# EAGLE design sortirovka (EAGLE 8.0.1)
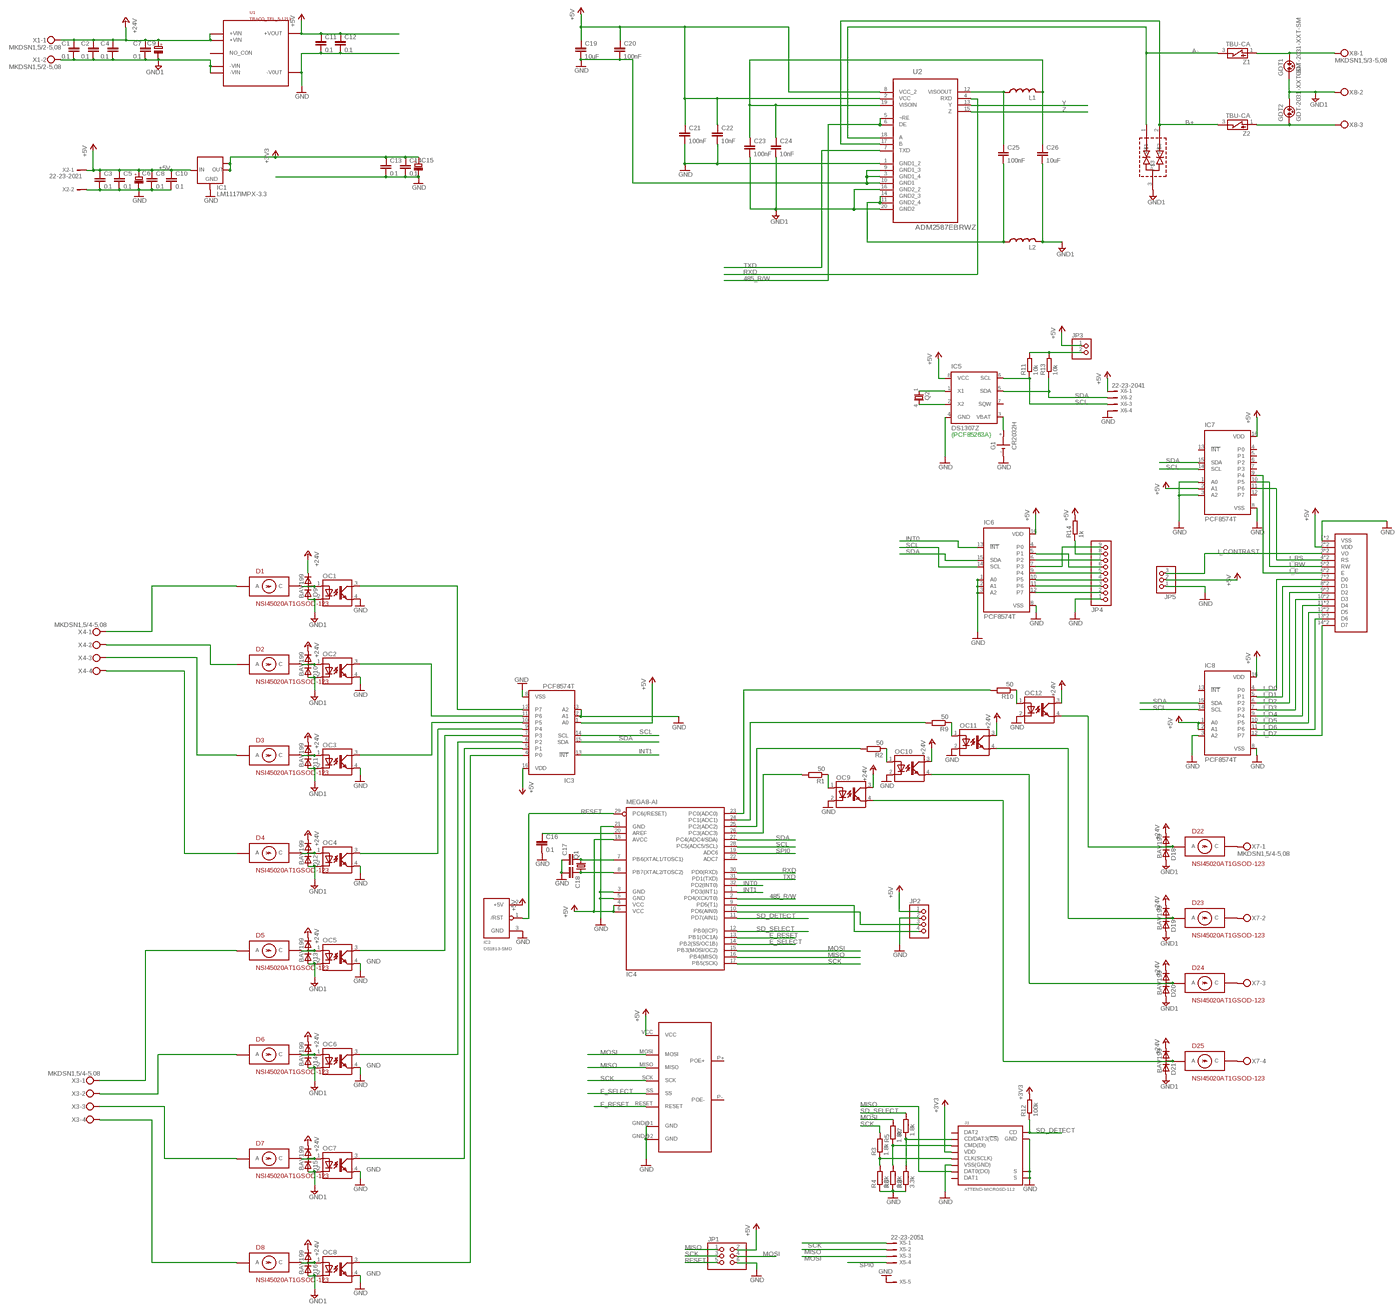
[diagram p0: schematic, sheet 1, overview]
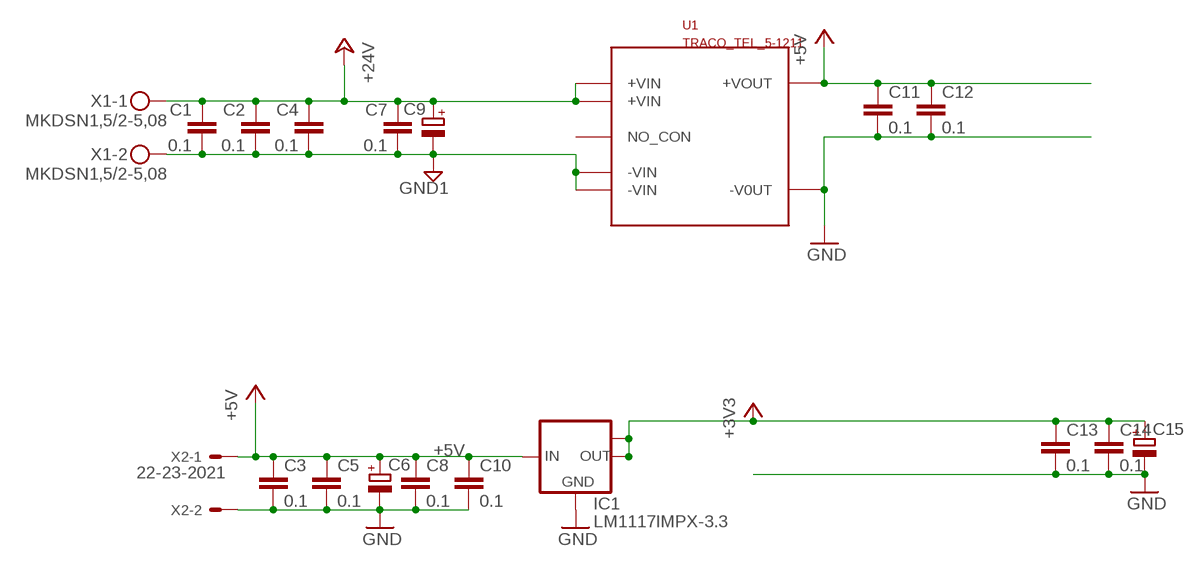
[diagram p1: schematic, sheet 1, part 1 of 4]
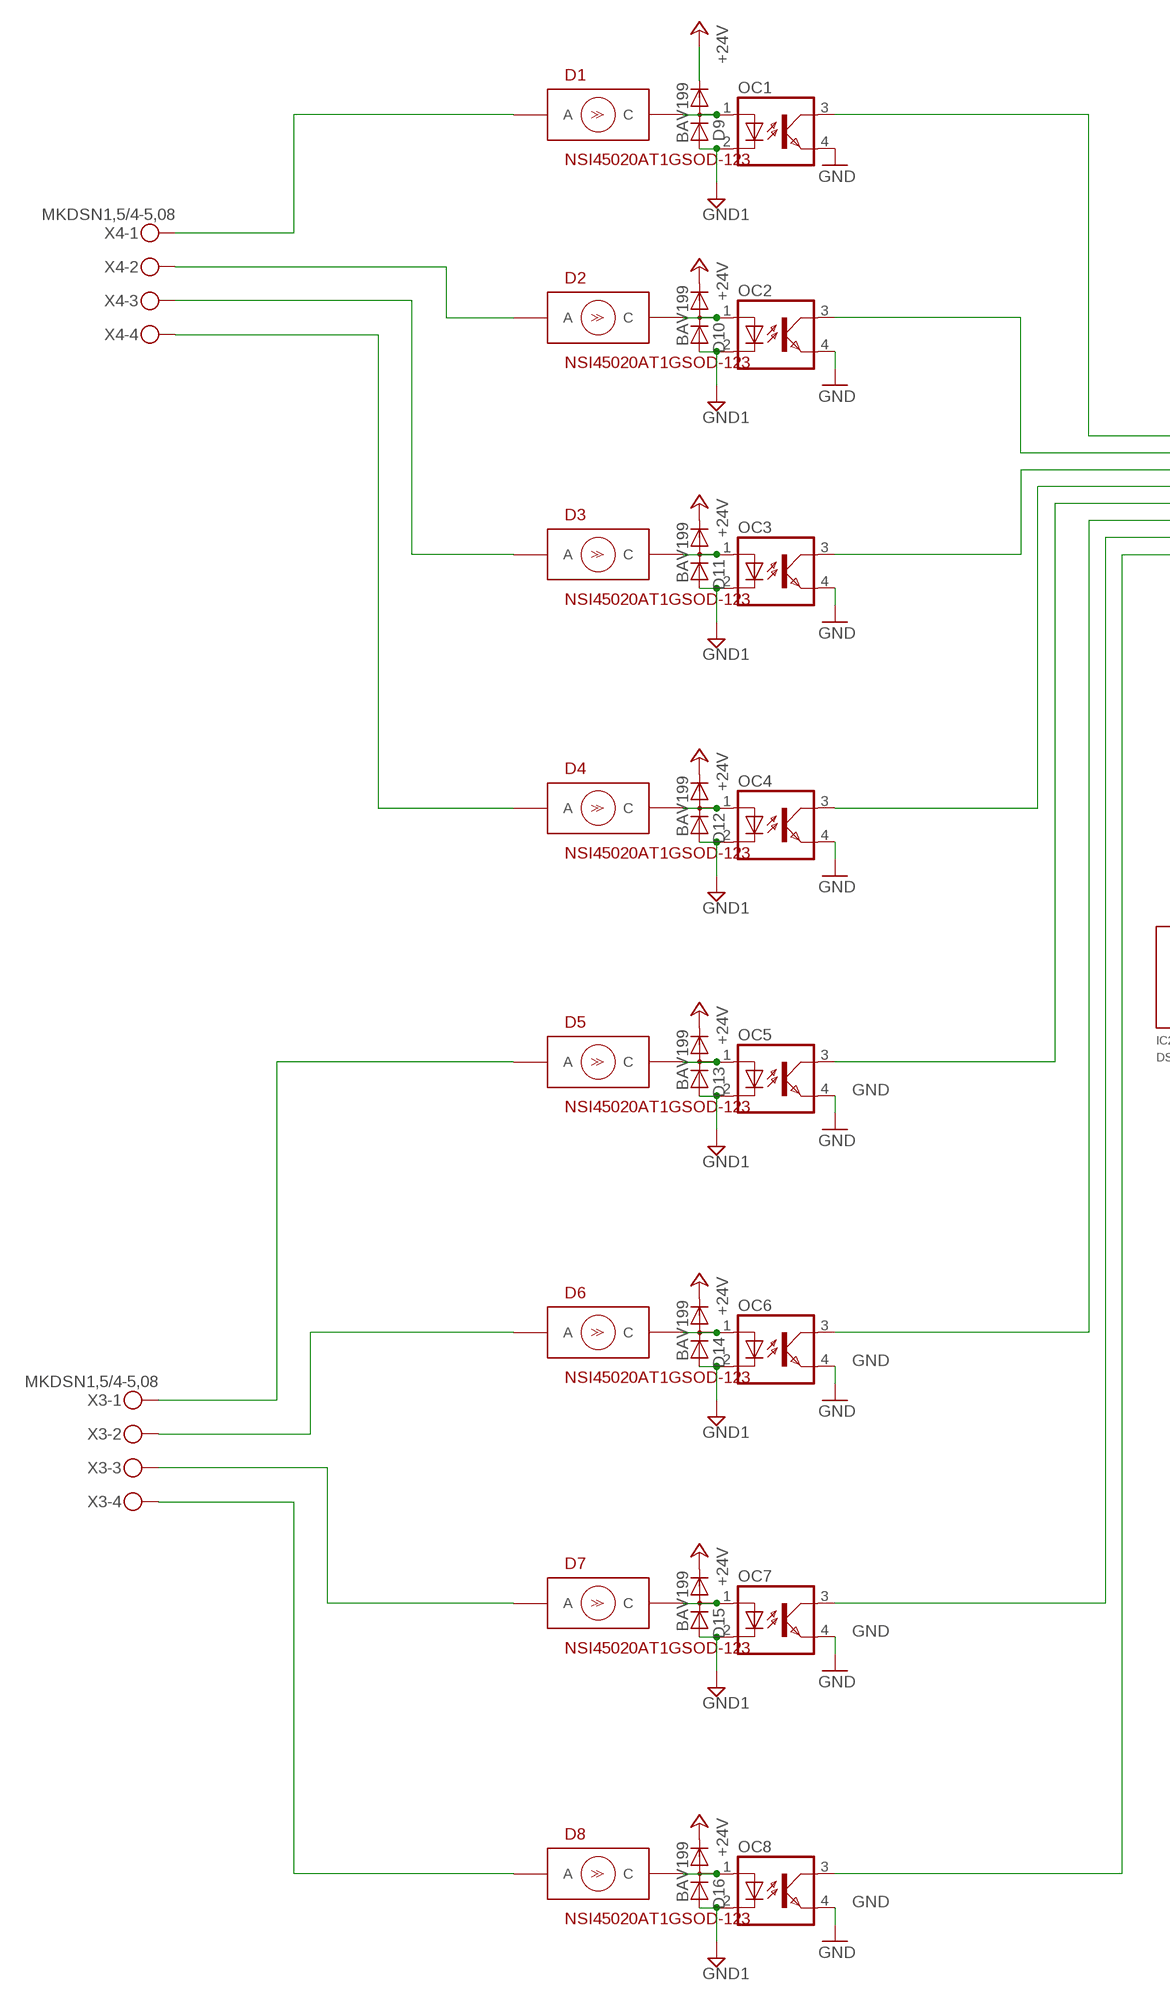
[diagram p2: schematic, sheet 1, part 2 of 4]
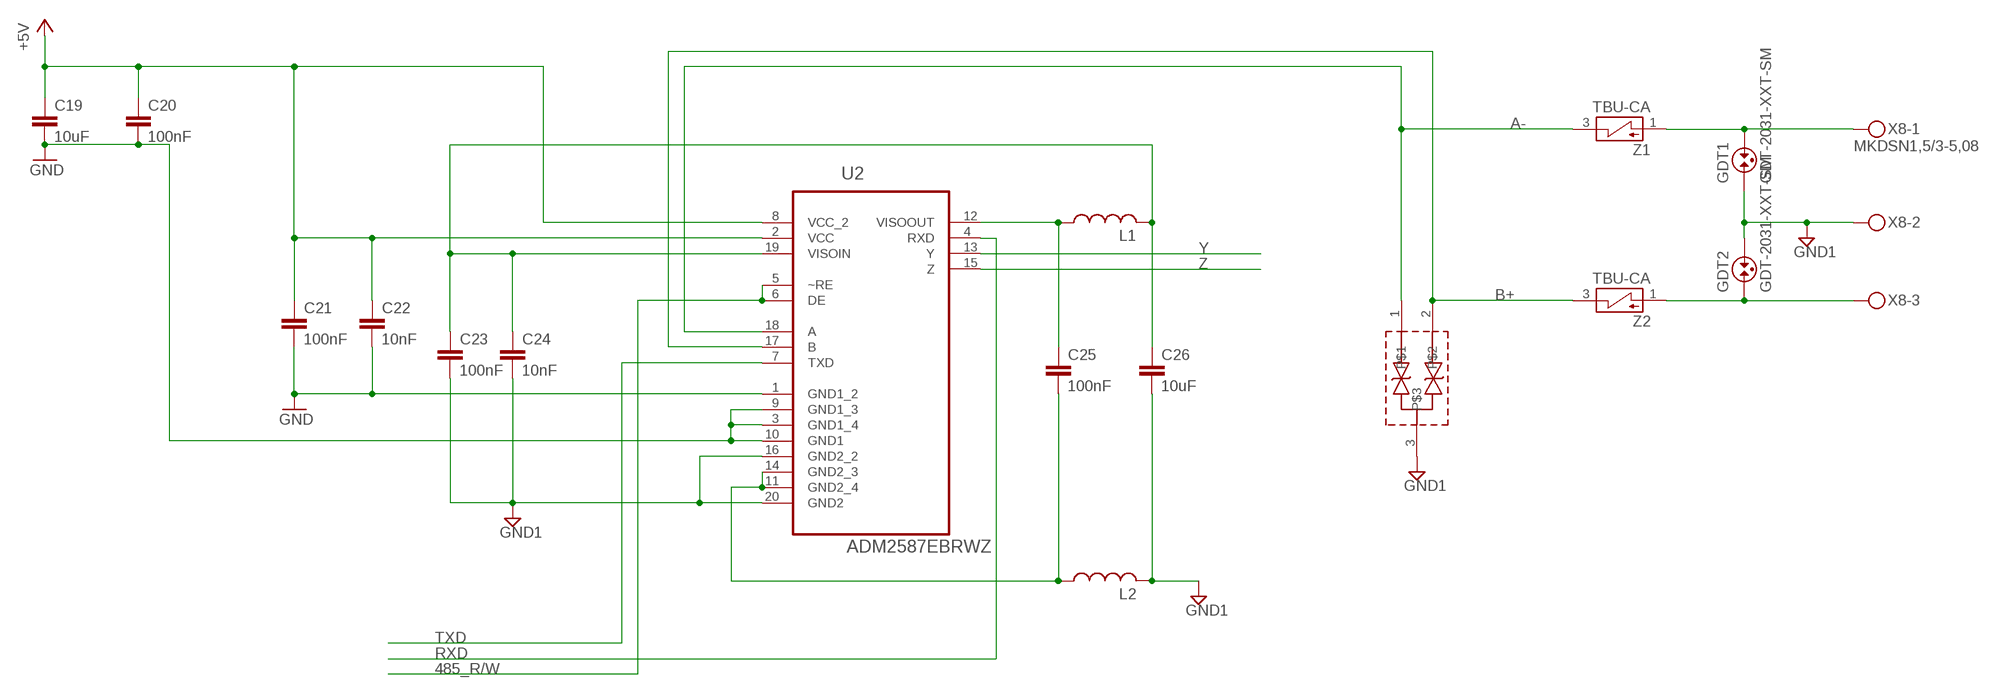
[diagram p3: schematic, sheet 1, part 3 of 4]
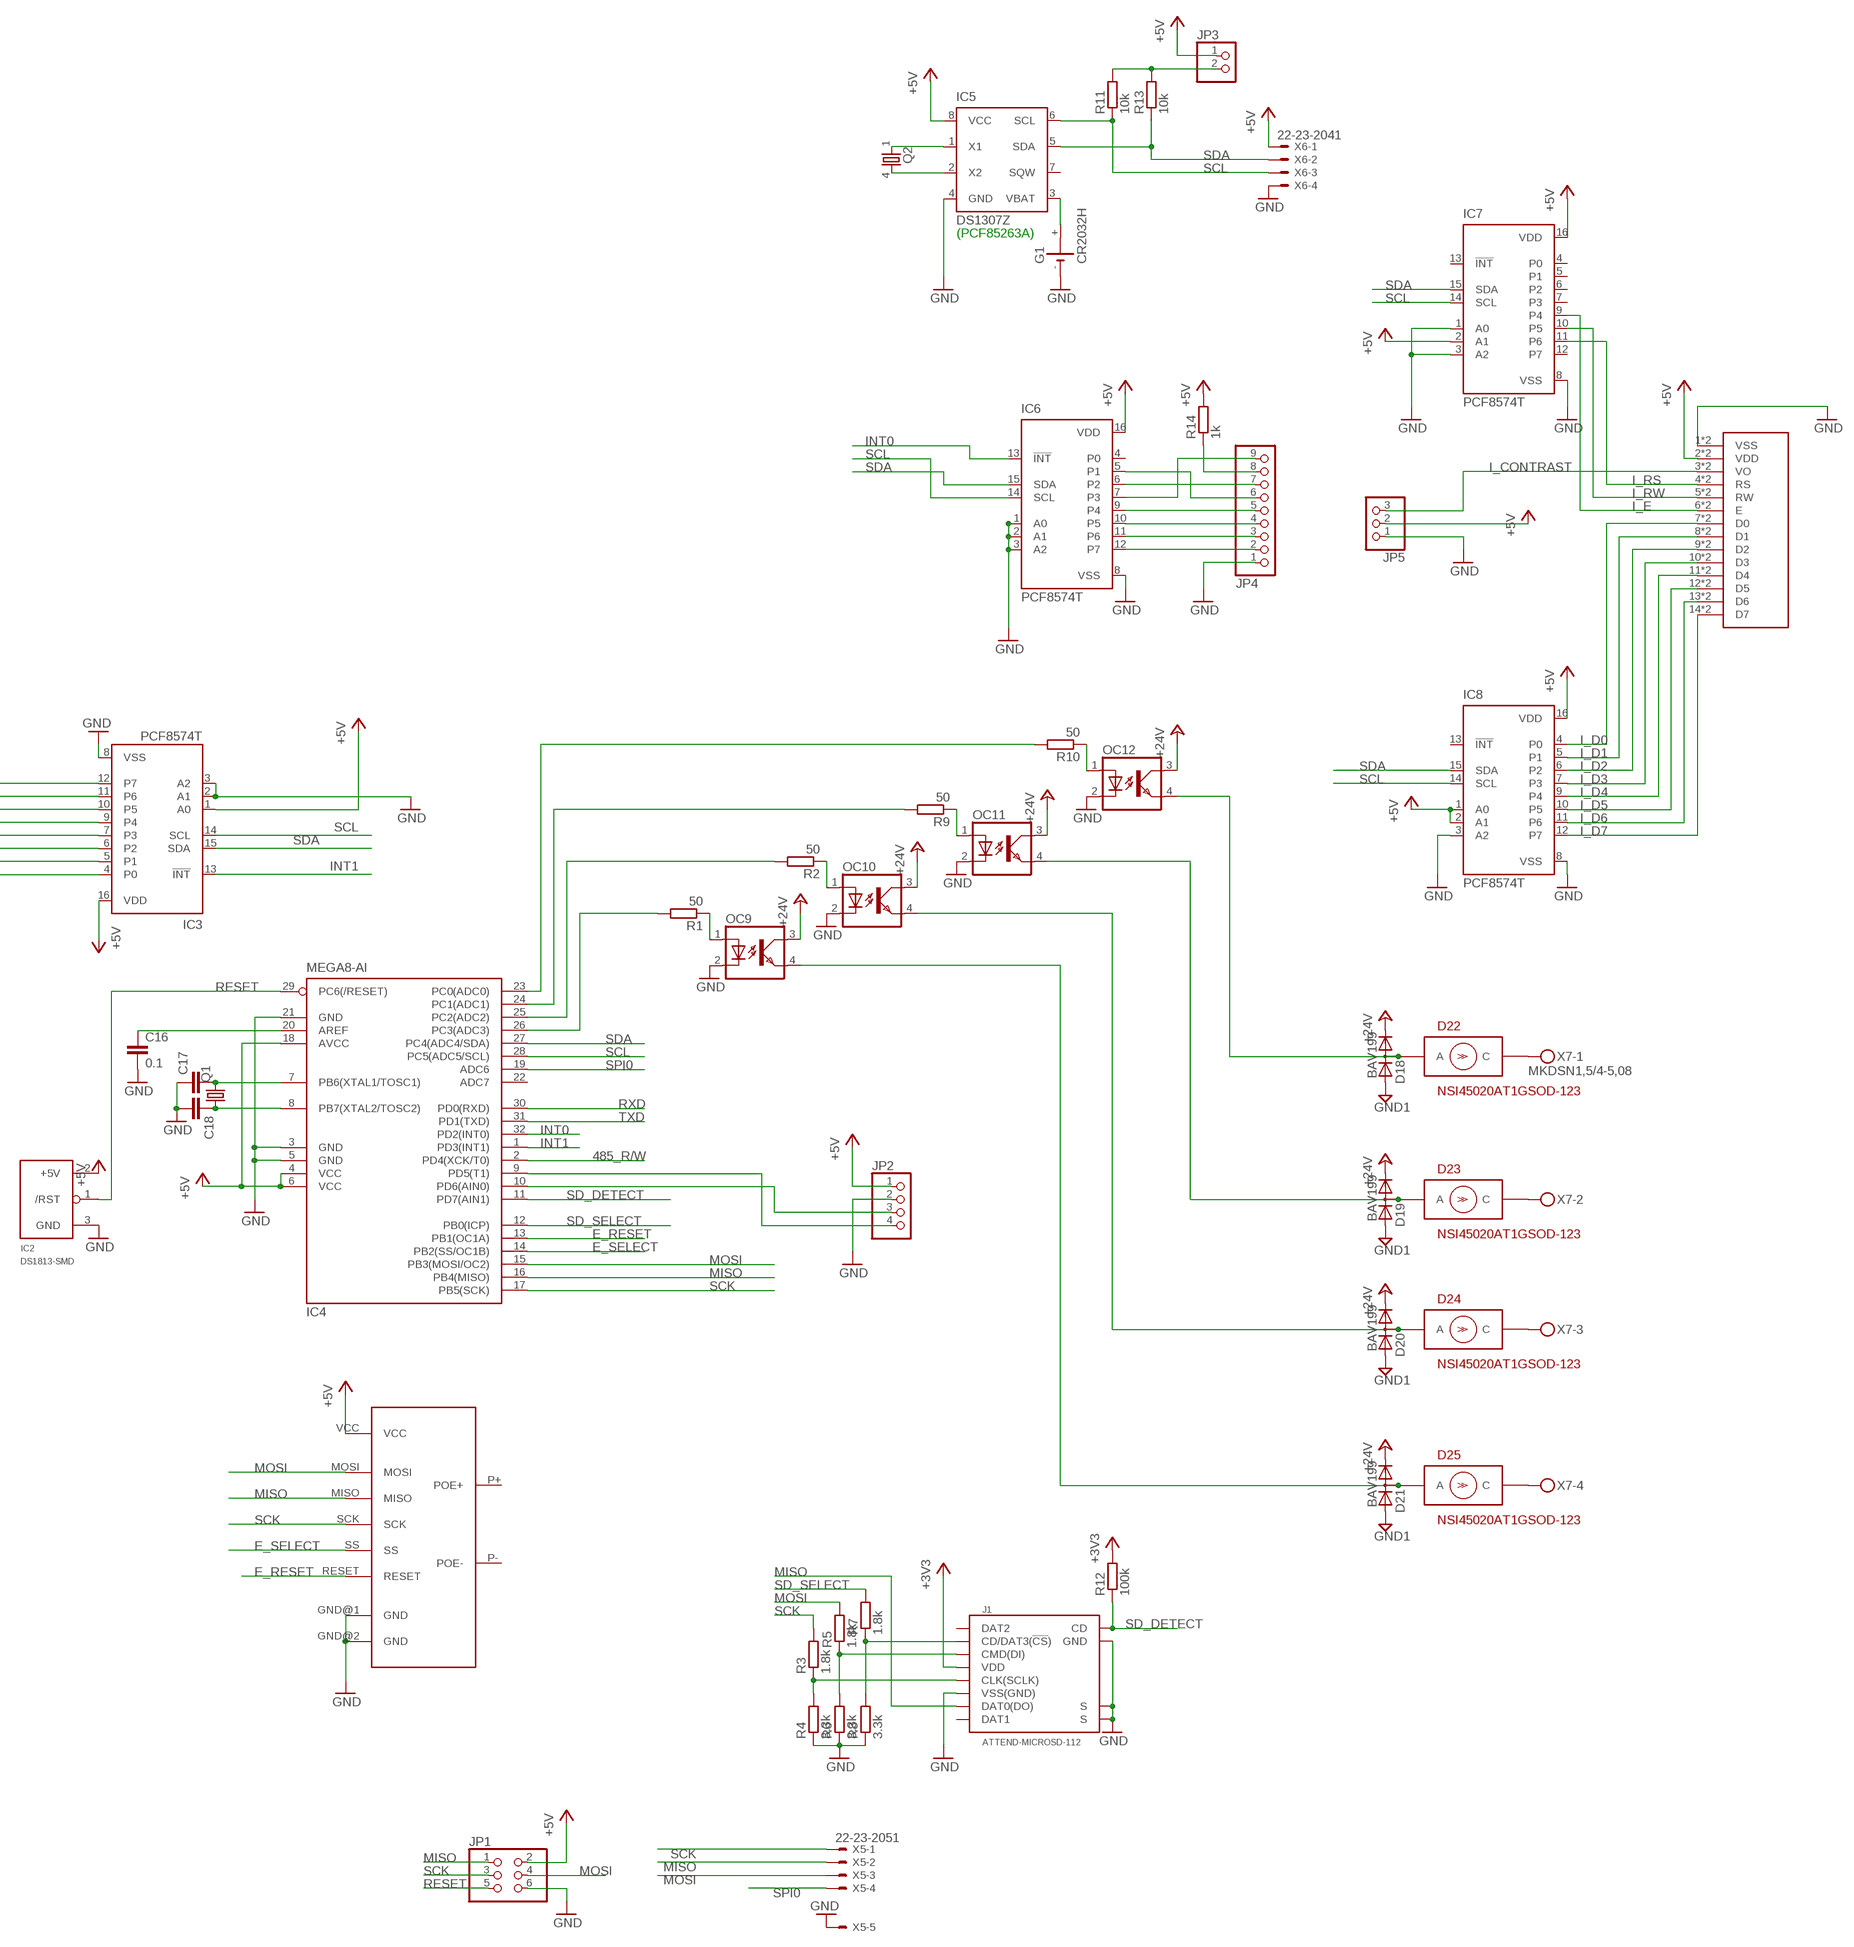
[diagram p4: schematic, sheet 1, part 4 of 4]

## Parts
C1  0.1  C-EUC0805  [C0805]
C2  0.1  C-EUC0805  [C0805]
C3  0.1  C-EUC0805  [C0805]
C4  0.1  C-EUC0805  [C0805]
C5  0.1  C-EUC0805  [C0805]
C6  CPOL-EU153CLV-0605  [153CLV-0605]
C7  0.1  C-EUC0805  [C0805]
C8  0.1  C-EUC0805  [C0805]
C9  CPOL-EU153CLV-0605  [153CLV-0605]
C10  0.1  C-EUC0805  [C0805]
C11  0.1  C-EUC0805  [C0805]
C12  0.1  C-EUC0805  [C0805]
C13  0.1  C-EUC0805  [C0805]
C14  0.1  C-EUC0805  [C0805]
C15  CPOL-EU153CLV-0605  [153CLV-0605]
C16  0.1  C-EUC0805  [C0805]
C17  C-EUC0805  [C0805]
C18  C-EUC0805  [C0805]
C19  10uF  C-EUC0805  [C0805]
C20  100nF  C-EUC0805  [C0805]
C21  100nF  C-EUC0805  [C0805]
C22  10nF  C-EUC0805  [C0805]
C23  100nF  C-EUC0805  [C0805]
C24  10nF  C-EUC0805  [C0805]
C25  100nF  C-EUC0805  [C0805]
C26  10uF  C-EUC0805  [C0805]
D1  NSI45020AT1GSOD-123  [SOD123]
D2  NSI45020AT1GSOD-123  [SOD123]
D3  NSI45020AT1GSOD-123  [SOD123]
D4  NSI45020AT1GSOD-123  [SOD123]
D5  NSI45020AT1GSOD-123  [SOD123]
D6  NSI45020AT1GSOD-123  [SOD123]
D7  NSI45020AT1GSOD-123  [SOD123]
D8  NSI45020AT1GSOD-123  [SOD123]
D9  BAV199  [SOT23]
D10  BAV199  [SOT23]
D11  BAV199  [SOT23]
D12  BAV199  [SOT23]
D13  BAV199  [SOT23]
D14  BAV199  [SOT23]
D15  BAV199  [SOT23]
D16  BAV199  [SOT23]
D17  CDSOT23-SM712SOT23-R  [SOT23-R]
D18  BAV199  [SOT23]
D19  BAV199  [SOT23]
D20  BAV199  [SOT23]
D21  BAV199  [SOT23]
D22  NSI45020AT1GSOD-123  [SOD123]
D23  NSI45020AT1GSOD-123  [SOD123]
D24  NSI45020AT1GSOD-123  [SOD123]
D25  NSI45020AT1GSOD-123  [SOD123]
G1  CR2032H  [CR2032H]
GDT1  GDT-2031-XXT-SM  [2031-XXT-SM]
GDT2  GDT-2031-XXT-SM  [2031-XXT-SM]
IC1  LM1117IMPX-3.3  [SOT223]
IC2  DS1813-SMD  [SOT-23]
IC3  PCF8574T  [SO16W]
IC4  MEGA8-AI  [TQFP32-08]
IC5  DS1307Z  [SOIC8]
IC6  PCF8574T  [SO16W]
IC7  PCF8574T  [SO16W]
IC8  PCF8574T  [SO16W]
J1  ATTEND-MICROSD-112  [ATTEND-112]
JP1  PINHD-2X3  [2X03]
JP2  PINHD-1X4  [1X04]
JP3  PINHD-1X2  [1X02]
JP4  PINHD-1X9  [1X09]
JP5  PINHD-1X3  [1X03]
L1  L-US0402  [L0402]
L2  L-US0402  [L0402]
LCD1  2X16LCDBOTHM162SD07  [2X16LCDBOTH-1]
MOD1  W5100_MODULESMALL  [W5100_MODULE_1]
OC1  SFH6106REAL  [SFH6106]
OC2  SFH6106REAL  [SFH6106]
OC3  SFH6106REAL  [SFH6106]
OC4  SFH6106REAL  [SFH6106]
OC5  SFH6106REAL  [SFH6106]
OC6  SFH6106REAL  [SFH6106]
OC7  SFH6106REAL  [SFH6106]
OC8  SFH6106REAL  [SFH6106]
OC9  SFH6106REAL  [SFH6106]
OC10  SFH6106REAL  [SFH6106]
OC11  SFH6106REAL  [SFH6106]
OC12  SFH6106REAL  [SFH6106]
Q1  CRYSTALSM49  [SM49]
Q2  MA306  [MA306]
R1  50  R-EU_R0805  [R0805]
R2  50  R-EU_R0805  [R0805]
R3  1.8k  R-EU_M0805  [M0805]
R4  3.3k  R-EU_M0805  [M0805]
R5  1.8k  R-EU_M0805  [M0805]
R6  3.3k  R-EU_M0805  [M0805]
R7  1.8k  R-EU_M0805  [M0805]
R8  3.3k  R-EU_M0805  [M0805]
R9  50  R-EU_R0805  [R0805]
R10  50  R-EU_R0805  [R0805]
R11  10k  R-EU_R0805  [R0805]
R12  100k  R-EU_M0805  [M0805]
R13  10k  R-EU_R0805  [R0805]
R14  1k  R-EU_R0805  [R0805]
U1  TRACO_TEL_5-1211  [TRACO_POWER_TL5]
U2  ADM2587EBRWZ  [SOIC127P1032X265-20N]
X1  MKDSN1,5/2-5,08  [MKDSN1,5/2-5,08]
X2  22-23-2021  [22-23-2021]
X3  MKDSN1,5/4-5,08  [MKDSN1,5/4-5,08]
X4  MKDSN1,5/4-5,08  [MKDSN1,5/4-5,08]
X5  22-23-2051  [22-23-2051]
X6  22-23-2041  [22-23-2041]
X7  MKDSN1,5/4-5,08  [MKDSN1,5/4-5,08]
X8  MKDSN1,5/3-5,08  [MKDSN1,5/3-5,08]
Z1  TBU-CA  [TBU-CA]
Z2  TBU-CA  [TBU-CA]

## Nets
485_R/W: IC4.2(PD4(XCK/T0)) U2.5(~RE) U2.6(DE)
+3V3: C13.1 C14.1 C15.+ IC1.2(OUT) IC1.TAB(OUT1) J1.VDD R12.2
+5V: C3.1 C5.1 C6.+ C8.1 C10.1 C11.1 C12.1 C19.1 C20.1 C21.1 C22.1 IC1.3(IN) IC2.2(+5V) IC3.1(A0) IC3.16(VDD) IC4.4(VCC) IC4.6(VCC) IC4.18(AVCC) IC5.8(VCC) IC6.16(VDD) IC7.2(A1) IC7.16(VDD) IC8.1(A0) IC8.2(A1) IC8.16(VDD) JP1.2 JP2.1 JP3.1 JP5.2 LCD1.2(VDD) LCD1.16(VDD) MOD1.VCC R14.2 U1.+VOUT U2.2(VCC) U2.8(VCC_2) X2.1 X6.1
+24V: C1.1 C2.1 C4.1 C7.1 C9.+ D9.2(C) D10.2(C) D11.2(C) D12.2(C) D13.2(C) D14.2(C) D15.2(C) D16.2(C) D18.2(C) D19.2(C) D20.2(C) D21.2(C) OC9.3(COL) OC10.3(COL) OC11.3(COL) OC12.3(COL) U1.+VIN@1(+VIN) U1.+VIN@2(+VIN) X1.1
A-: D17.1 U2.18(A) Z1.3
B+: D17.2 U2.17(B) Z2.3
E_RESET: IC4.13(PB1(OC1A)) MOD1.RESET
E_SELECT: IC4.14(PB2(SS/OC1B)) MOD1.SS
GND: C3.2 C5.2 C6.- C8.2 C10.2 C11.2 C12.2 C13.2 C14.2 C15.- C16.2 C17.1 C18.2 C19.2 C20.2 C21.2 C22.2 G1.- IC1.1(GND) IC2.3(GND) IC3.2(A1) IC3.3(A2) IC3.8(VSS) IC4.3(GND) IC4.5(GND) IC4.21(GND) IC5.4(GND) IC6.1(A0) IC6.2(A1) IC6.3(A2) IC6.8(VSS) IC7.1(A0) IC7.3(A2) IC7.8(VSS) IC8.3(A2) IC8.8(VSS) J1.GND J1.S1(S) J1.S2(S) J1.VSS(VSS(GND)) JP1.6 JP2.2 JP4.1 JP5.1 LCD1.1(VSS) LCD1.15(VSS) MOD1.GND@1(GND) MOD1.GND@2(GND) OC1.4(EMIT) OC2.4(EMIT) OC3.4(EMIT) OC4.4(EMIT) OC5.4(EMIT) OC6.4(EMIT) OC7.4(EMIT) OC8.4(EMIT) OC9.2(C) OC10.2(C) OC11.2(C) OC12.2(C) R4.1 R6.1 R8.1 U1.-VOUT(-V0UT) U2.1(GND1_2) U2.3(GND1_4) U2.9(GND1_3) U2.10(GND1) X2.2 X5.5 X6.4
GND1: C1.2 C2.2 C4.2 C7.2 C9.- C23.2 C24.2 C26.2 D9.1(A) D10.1(A) D11.1(A) D12.1(A) D13.1(A) D14.1(A) D15.1(A) D16.1(A) D17.3 D18.1(A) D19.1(A) D20.1(A) D21.1(A) GDT1.1 GDT2.2 L2.2 OC1.2(C) OC2.2(C) OC3.2(C) OC4.2(C) OC5.2(C) OC6.2(C) OC7.2(C) OC8.2(C) U1.-VIN@1(-VIN) U1.-VIN@2(-VIN) U2.16(GND2_2) U2.20(GND2) X1.2 X8.2
I_CONTRAST: JP5.3 LCD1.3(VO) LCD1.17(VO)
I_D0: IC8.4(P0) LCD1.7(D0) LCD1.21(D0)
I_D1: IC8.5(P1) LCD1.8(D1) LCD1.22(D1)
I_D2: IC8.6(P2) LCD1.9(D2) LCD1.23(D2)
I_D3: IC8.7(P3) LCD1.10(D3) LCD1.24(D3)
I_D4: IC8.9(P4) LCD1.11(D4) LCD1.25(D4)
I_D5: IC8.10(P5) LCD1.12(D5) LCD1.26(D5)
I_D6: IC8.11(P6) LCD1.13(D6) LCD1.27(D6)
I_D7: IC8.12(P7) LCD1.14(D7) LCD1.28(D7)
I_E: IC7.9(P4) LCD1.6(E) LCD1.20(E)
I_RS: IC7.11(P6) LCD1.4(RS) LCD1.18(RS)
I_RW: IC7.10(P5) LCD1.5(RW) LCD1.19(RW)
INT0: IC4.32(PD2(INT0)) IC6.13(!INT)
INT1: IC3.13(!INT) IC4.1(PD3(INT1))
MISO: IC4.16(PB4(MISO)) J1.DAT0(DAT0(DO)) JP1.1 MOD1.MISO X5.2
MOSI: IC4.15(PB3(MOSI/OC2)) JP1.4 MOD1.MOSI R5.2 X5.3
N$1: GDT1.2 X8.1 Z1.1
N$2: GDT2.1 X8.3 Z2.1
N$3: C23.1 C24.1 C26.1 L1.2 U2.19(VISOIN)
N$4: C25.2 L2.1 U2.11(GND2_4) U2.14(GND2_3)
N$5: C25.1 L1.1 U2.12(VISOOUT)
N$6: IC4.23(PC0(ADC0)) R10.2
N$7: IC4.24(PC1(ADC1)) R9.2
N$8: IC4.25(PC2(ADC2)) R2.2
N$9: IC4.26(PC3(ADC3)) R1.2
N$10: D18.3(AC) D22.A OC12.4(EMIT)
N$11: D19.3(AC) D23.A OC11.4(EMIT)
N$12: D20.3(AC) D24.A OC10.4(EMIT)
N$13: D21.3(AC) D25.A OC9.4(EMIT)
N$14: C18.1 IC4.8(PB7(XTAL2/TOSC2)) Q1.1
N$15: OC9.1(A) R1.1
N$16: D1.C D9.3(AC) OC1.1(A)
N$17: D2.C D10.3(AC) OC2.1(A)
N$18: OC10.1(A) R2.1
N$19: OC11.1(A) R9.1
N$20: G1.+ IC5.3(VBAT)
N$21: D1.A X4.1
N$22: D2.A X4.2
N$23: IC5.1(X1) Q2.1
N$24: D3.C D11.3(AC) OC3.1(A)
N$25: IC5.2(X2) Q2.4
N$26: C17.2 IC4.7(PB6(XTAL1/TOSC1)) Q1.2
N$27: D4.C D12.3(AC) OC4.1(A)
N$28: D7.A X3.3
N$29: OC12.1(A) R10.1
N$30: D5.C D13.3(AC) OC5.1(A)
N$32: D6.C D14.3(AC) OC6.1(A)
N$33: D4.A X4.4
N$34: D7.C D15.3(AC) OC7.1(A)
N$35: D3.A X4.3
N$36: D8.C D16.3(AC) OC8.1(A)
N$37: D5.A X3.1
N$38: D6.A X3.2
N$39: D8.A X3.4
N$40: IC3.6(P2) OC6.3(COL)
N$41: IC3.5(P1) OC7.3(COL)
N$42: IC3.4(P0) OC8.3(COL)
N$43: J1.DAT3(CD/DAT3(!CS!)) R7.1 R8.2
N$45: IC6.12(P7) JP4.2
N$46: IC6.11(P6) JP4.3
N$47: IC6.10(P5) JP4.4
N$48: IC6.5(P1) JP4.6
N$49: IC6.9(P4) JP4.5
N$50: IC6.7(P3) JP4.9
N$51: IC6.6(P2) JP4.7
N$53: JP4.8 R14.1
N$54: IC3.12(P7) OC1.3(COL)
N$55: IC3.11(P6) OC2.3(COL)
N$56: IC3.10(P5) OC3.3(COL)
N$57: IC3.9(P4) OC4.3(COL)
N$58: IC3.7(P3) OC5.3(COL)
N$59: J1.CMD(CMD(DI)) R5.1 R6.2
N$60: J1.CLK(CLK(SCLK)) R3.1 R4.2
N$61: C16.1 IC4.20(AREF)
N$62: D22.C X7.1
N$63: D23.C X7.2
N$64: IC4.10(PD6(AIN0)) JP2.3
N$65: D24.C X7.3
N$66: IC4.9(PD5(T1)) JP2.4
N$67: D25.C X7.4
N$68: JP3.2 R11.2 R13.2
RESET: IC2.1(/RST) IC4.29(PC6(/RESET)) JP1.5
RXD: IC4.30(PD0(RXD)) U2.4(RXD)
SCK: IC4.17(PB5(SCK)) JP1.3 MOD1.SCK R3.2 X5.1
SCL: IC3.14(SCL) IC4.28(PC5(ADC5/SCL)) IC5.6(SCL) IC6.14(SCL) IC7.14(SCL) IC8.14(SCL) R11.1 X6.3
SD_DETECT: IC4.11(PD7(AIN1)) J1.CD R12.1
SD_SELECT: IC4.12(PB0(ICP)) R7.2
SDA: IC3.15(SDA) IC4.27(PC4(ADC4/SDA)) IC5.5(SDA) IC6.15(SDA) IC7.15(SDA) IC8.15(SDA) R13.1 X6.2
SPI0: IC4.19(ADC6) X5.4
TXD: IC4.31(PD1(TXD)) U2.7(TXD)
Y: U2.13(Y)
Z: U2.15(Z)
Unconnected: IC4.22(ADC7) IC5.7(SQW) IC6.4(P0) IC7.4(P0) IC7.5(P1) IC7.6(P2) IC7.7(P3) IC7.12(P7) IC7.13(!INT) IC8.13(!INT) J1.DAT1 J1.DAT2 MOD1.P+(POE+) MOD1.P-(POE-) U1.NO_CON

## Notes on the sheet
- (PCF85263A)

## Library data of the parts
C1-C5 C7 C8 C10-C14 C16-C26 = rcl:C-EU: CAPACITOR, European symbol
C6 C9 C15 = rcl:CPOL-EU: POLARIZED CAPACITOR, European symbol
D1-D8 D22-D25 = MyLib:NSI45020AT1G: Constant current source
D9-D16 D18-D21 = MyLib:BAV199: DIODE low-leakage double diode
D17 = MyLib:CDSOT23-SM712: DUAL BIDIRECTIONAL VOLTAGE SUPPRESSOR 350 W PEAK POWER
G1 = MyLib:CR2032H: LI BATTERY Varta
GDT1 GDT2 = supressor:GDT-: GAS DISCHARGE TUBE
IC1 = lm1117:LM1117IMPX-*
IC2 = MyLib:DS1813
IC3 IC6-IC8 = micro-philips:PCF8574: I2C-Bus Remote 8-bit I/O expander http://www.semiconductors.philips.com/acrobat_download/datasheets/PCF8574_4.pdf; MPN: PCF8574T/3,512; OC_FARNELL: 1201255; OC_NEWARK: 70R6870
IC4 = atmel:MEGA8: MICROCONTROLLER 8 Kbytes FLASH, 1 kbytes SRAM, 512 bytes EEPROM, USART, 6-channel 10 bit ADC, 2-channel 8 bit ADC Pin compatible with Atmega48, ATMega88, ATMega168 Source: avr.lbr; MPN: ATMEGA8-16AU; OC_FARNELL: 9171371; OC_NEWARK: 73M8863
IC5 = MyLib:DS1307: I2C-Bus CLOCK/CALENDAR
J1 = sd-mmc:ATTEND-MICROSD-112: Attend microSD socket Datasheet: Attend 112 microSD socket <http://www.soselectronic.com/a_info/resource/f/112I-TXAR-R_B_1.pdf>.
JP1 = pinhead:PINHD-2X3: PIN HEADER
JP2 = pinhead:PINHD-1X4: PIN HEADER
JP3 = pinhead:PINHD-1X2: PIN HEADER
JP4 = pinhead:PINHD-1X9: PIN HEADER
JP5 = pinhead:PINHD-1X3: PIN HEADER
L1 L2 = rcl:L-US: INDUCTOR, American symbol
LCD1 = MyLib:2X16LCDBOTH
MOD1 = MyLib:W5100_MODULE
OC1-OC12 = MyLib:SFH6106: SIEMENS OPTO COUPLER
Q1 = crystal:CRYSTAL: CRYSTAL; OC_FARNELL: unknown; OC_NEWARK: unknown
Q2 = MyLib:MA306
R1-R14 = rcl:R-EU_: RESISTOR, European symbol
U1 = MyLib:TRACO_TEL_5-1211
U2 = Analog Devices_By_element14_Batch_1:ADM2587EBRWZ: Signal and Power Isolated RS-485 Transceiver with ±15 kV ESD Protection; MPN: ADM2587EBRWZ; OC_FARNELL: 1827333; OC_NEWARK: 33R2688; PACKAGE: SOIC-20; SUPPLIER: Analog Devices
X1 = con-phoenix-508:MKDSN1,5/2-5,08: MKDSN 1,5/ 2-5,08 Printklemme Nennstrom: 13,5 A Nennspannung: 250 V Rastermaß: 5,08 mm Polzahl: 2 Anschlussart: Schraubanschluss Montage: Löten Anschlussrichtung Leiter/Platine: 0 ° Artikelnummer: 1729128 Source: http://eshop.phoenixcontact.com .. 1729128.pdf
X2 = con-molex:22-23-2021: .100" (2.54mm) Center Header - 2 Pin; MF: MOLEX; MPN: 22-23-2021; OC_FARNELL: 1462926; OC_NEWARK: 25C3832
X3 X4 X7 = con-phoenix-508:MKDSN1,5/4-5,08: MKDSN 1,5/ 4-5,08 Printklemme Nennstrom: 13,5 A Nennspannung: 250 V Rastermaß: 5,08 mm Polzahl: 4 Anschlussart: Schraubanschluss Montage: Löten Anschlussrichtung Leiter/Platine: 0 ° Artikelnummer: 1729144 Source: http://eshop.phoenixcontact.com .. 1729144.pdf
X5 = con-molex:22-23-2051: .100" (2.54mm) Center Header - 5 Pin; MF: MOLEX; MPN: 22-23-2051; OC_FARNELL: 1462952; OC_NEWARK: 38C9178
X6 = con-molex:22-23-2041: .100" (2.54mm) Center Header - 4 Pin; MF: MOLEX; MPN: 22-23-2041; OC_FARNELL: 1462920; OC_NEWARK: 38C0355
X8 = MyLib:MKDSN1,5/3-5,08: MKDSN 1,5/ 3-5,08 Printklemme Nennstrom: 13,5 A Nennspannung: 250 V Rastermaß: 5,08 mm Polzahl: 3 Anschlussart: Schraubanschluss Montage: Löten Anschlussrichtung Leiter/Platine: 0 ° Artikelnummer: 1729131 Source: http://eshop.phoenixcontact.com .. 1729131.pdf
Z1 Z2 = supressor:TBU-CA: MOSFET CIRCUIT PROTECTOR

## Board
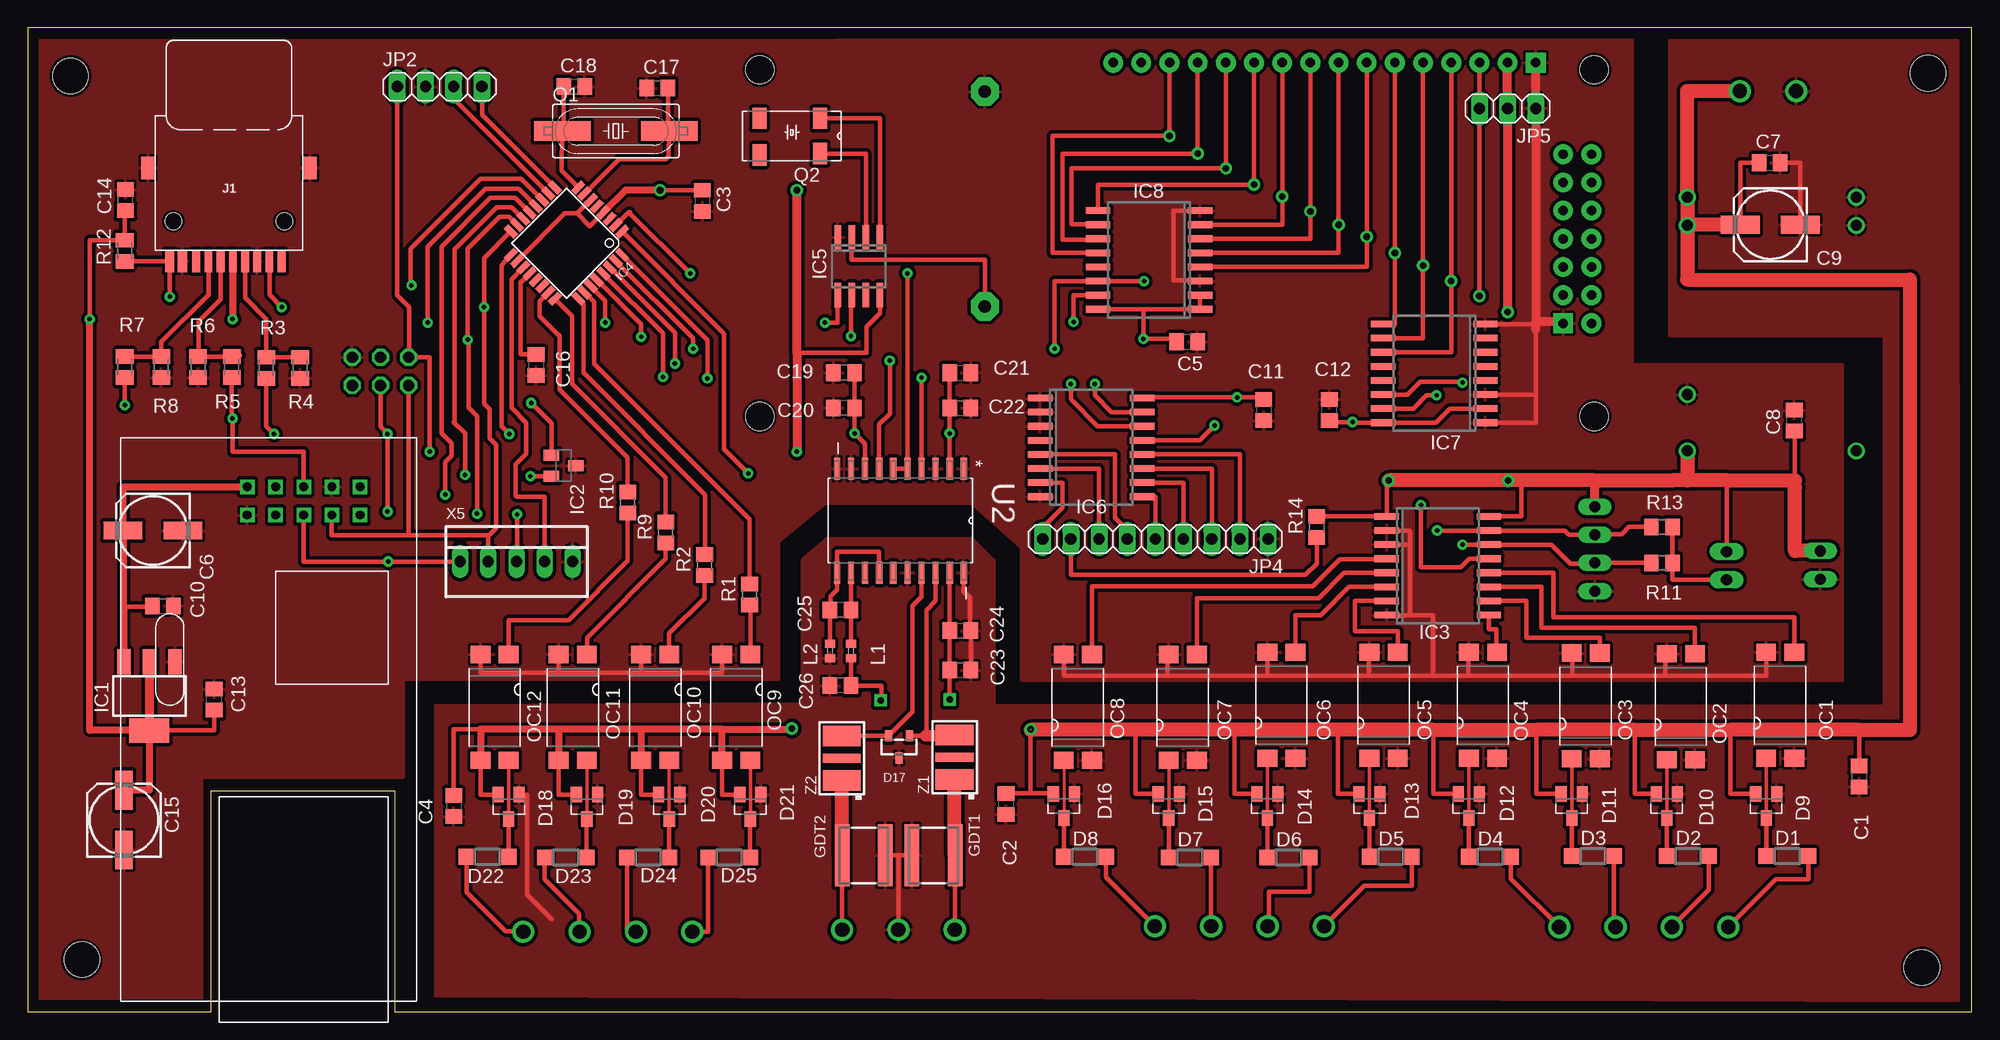
[diagram p5: board, top side]
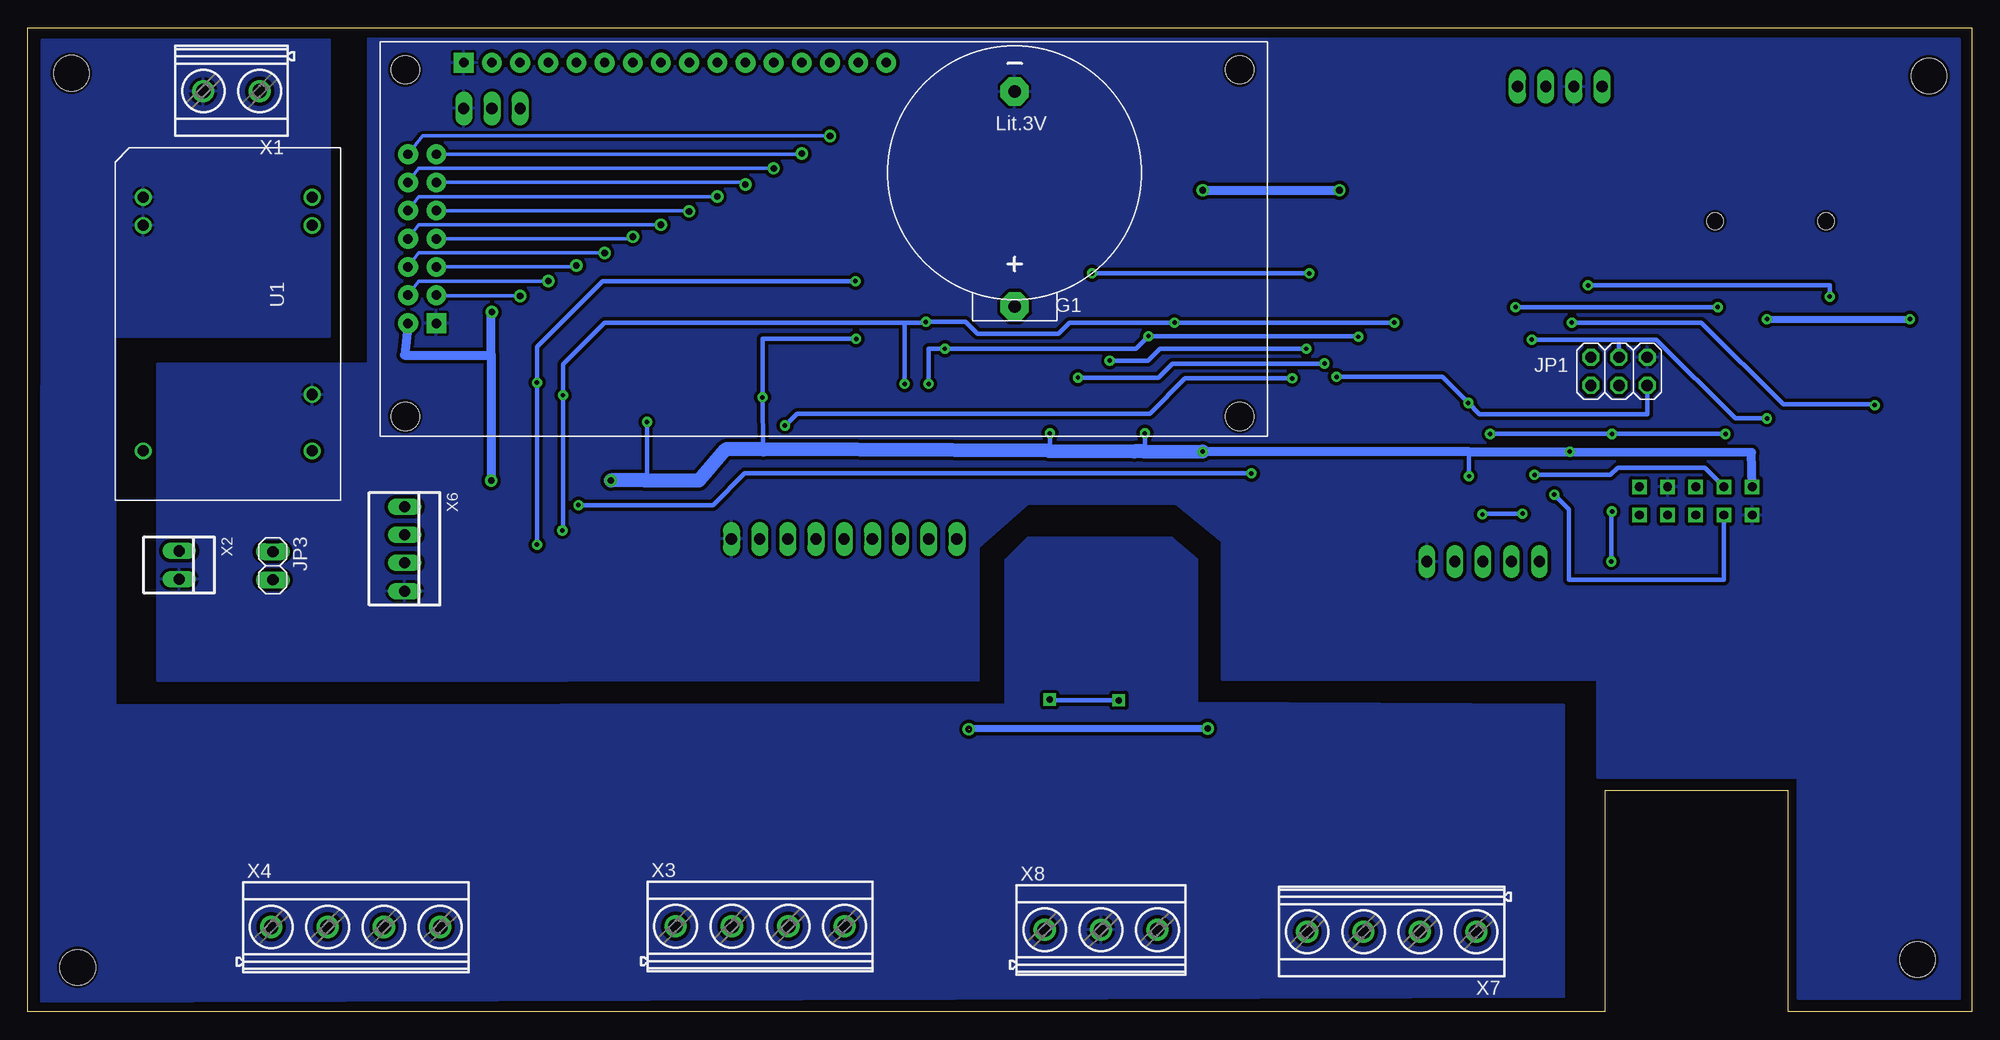
[diagram p6: board, bottom side, seen from below]

Size 175.24 x 88.68 mm. Coordinates in mm from the lower left corner, seen from the top.
Outline: 0,0.02 16.56,0.02 16.56,19.94 33.07,19.94 33.07,0 175.24,0.02 175.24,88.68 0,88.68 0,0.02
Copper layers (1*16): Top 0.035mm / dielectric 1.5mm / Bottom 0.035mm
Design rules "default *": minimum track width 10mil, minimum drill 32mil, track to track 12mil, track to pad 12mil, pad to pad 12mil, via to via 12mil, smd to smd 8mil, copper to edge 10mil, drill to drill 40mil, minimum pad ring 10mil, minimum via ring 10mil, stop-mask expansion 4mil, vias tented up to drill 0mil, thermal gap 10mil
Holes 3.2 mm at 170.74,4 171.31,84.58 4.87,4.7 3.86,84.33

### Footprints (pad centres in the part's own frame; a part is rotated, then mirrored left to right if it is on the bottom)
C0805 = smd 1.3 x 1.5: 1 -0.95,0; 2 0.95,0
153CLV-0605 = smd 3.5 x 1.6: + 2.7,0; - -2.7,0
SOD123 = smd 1.4 x 1.4: A 1.9,0; C -1.9,0
SOT23 = smd 1 x 1.4: 1 -0.95,-1.1; 2 0.95,-1.1; 3 0,1.1
SOT23-R = smd 0.635 x 1.016: 1 -0.95,-1; 2 0.95,-1; 3 0,1
CR2032H = drill 1.118 pad 2.54 octagon: + 0,12.065; - 0,-7.303
2031-XXT-SM = smd 1.3 x 5.6: 1 -1.95,0; 2 1.95,0
SOT223 = smd 1.219 x 2.235: 1 -2.311,-3.099; 2 0,-3.099; 3 2.311,-3.099 | smd 3.6 x 2.2: TAB 0,3.099
SOT-23 = smd 1 x 1.4: 1 -0.95,-1.1; 2 0.95,-1.1; 3 0,1.1
SO16W = smd 0.6 x 2.2: 1 -4.445,-4.6; 2 -3.175,-4.6; 3 -1.905,-4.6; 4 -0.635,-4.6; 5 0.635,-4.6; 6 1.905,-4.6; 7 3.175,-4.6; 8 4.445,-4.6; 9 4.445,4.6; 10 3.175,4.6; 11 1.905,4.6; 12 0.635,4.6; 13 -0.635,4.6; 14 -1.905,4.6; 15 -3.175,4.6; 16 -4.445,4.6
TQFP32-08 = smd 1.27 x 0.559: 1 -4.293,2.8; 2 -4.293,2; 3 -4.293,1.2; 4 -4.293,0.4; 5 -4.293,-0.4; 6 -4.293,-1.2; 7 -4.293,-2; 8 -4.293,-2.8; 17 4.293,-2.8; 18 4.293,-2; 19 4.293,-1.2; 20 4.293,-0.4; 21 4.293,0.4; 22 4.293,1.2; 23 4.293,2; 24 4.293,2.8 | smd 0.559 x 1.27: 9 -2.8,-4.293; 10 -2,-4.293; 11 -1.2,-4.293; 12 -0.4,-4.293; 13 0.4,-4.293; 14 1.2,-4.293; 15 2,-4.293; 16 2.8,-4.293; 25 2.8,4.293; 26 2,4.293; 27 1.2,4.293; 28 0.4,4.293; 29 -0.4,4.293; 30 -1.2,4.293; 31 -2,4.293; 32 -2.8,4.293
SOIC8 = smd 0.6 x 2.2: 1 -1.905,-2.6; 2 -0.635,-2.6; 3 0.635,-2.6; 4 1.905,-2.6; 5 1.905,2.6; 6 0.635,2.6; 7 -0.635,2.6; 8 -1.905,2.6
ATTEND-112 = smd 0.85 x 2: CD 5.35,8.62; GND 4.2,8.62 | smd 0.7 x 2: CLK -1.45,8.62; CMD 0.75,8.62; DAT0 -3.65,8.62; DAT1 -4.75,8.62; DAT2 2.95,8.62; DAT3 1.85,8.62; VDD -0.35,8.62; VSS -2.55,8.62 | smd 1.2 x 2: S1 -7.3,0.22; S2 7.3,0.22 | hole 1.5: -5,5.02; 5,5.02
2X03 = drill 1.016 octagon: 1 -2.54,-1.27; 2 -2.54,1.27; 3 0,-1.27; 4 0,1.27; 5 2.54,-1.27; 6 2.54,1.27
1X04 = drill 1.016 long: 1 -3.81,0; 2 -1.27,0; 3 1.27,0; 4 3.81,0
1X02 = drill 1.016 long: 1 -1.27,0; 2 1.27,0
1X09 = drill 1.016 long: 1 -10.16,0; 2 -7.62,0; 3 -5.08,0; 4 -2.54,0; 5 0,0; 6 2.54,0; 7 5.08,0; 8 7.62,0; 9 10.16,0
1X03 = drill 1.016 long: 1 -2.54,0; 2 0,0; 3 2.54,0
L0402 = smd 0.7 x 0.9: 1 -0.65,0; 2 0.65,0
2X16LCDBOTH-1 = drill 0.85 pad 1.778 square: 1 5.08,10.16; 15 7.553,33.655 | drill 0.85 pad 1.778: 2 2.54,10.16; 3 5.08,12.7; 4 2.54,12.7; 5 5.08,15.24; 6 2.54,15.24; 7 5.08,17.78; 8 2.54,17.78; 9 5.08,20.32; 10 2.54,20.32; 11 5.08,22.86; 12 2.54,22.86; 13 5.08,25.4; 14 2.54,25.4; 16 10.092,33.655; 17 12.633,33.655; 18 15.172,33.655; 19 17.712,33.655; 20 20.253,33.655; 21 22.793,33.655; 22 25.332,33.655; 23 27.872,33.655; 24 30.413,33.655; 25 32.953,33.655; 26 35.492,33.655; 27 38.032,33.655; 28 40.572,33.655; 29 43.112,33.655; 30 45.653,33.655 | hole 2.54: 2.286,1.778; 2.286,33.02; 77.495,33.02; 77.495,1.778
W5100_MODULE_1 = drill 0.8 square: GND@1 -1.905,18.415; GND@2 5.715,20.955; MISO 5.715,18.415; MOSI 3.175,20.955; P+ 8.255,18.415; P- 8.255,20.955; RESET 0.635,18.415; SCK 3.175,18.415; SS 0.635,20.955; VCC -1.905,20.955
SFH6106 = smd 1.78 x 1.55: 1 -1.27,-4.77; 2 1.27,-4.77; 3 1.27,4.77; 4 -1.27,4.77
SM49 = smd 5.08 x 1.778: 1 -4.826,0; 2 4.826,0
MA306 = smd 1.27 x 1.905: 1 -2.54,-1.27; 2 2.921,-1.27; 3 2.921,2.032; 4 -2.54,1.905
R0805 = smd 1.3 x 1.5: 1 -0.95,0; 2 0.95,0
M0805 = smd 1.3 x 1.6: 1 -0.95,0; 2 0.95,0
TRACO_POWER_TL5 = drill 1: +VIN@1 -11.43,7.62; +VIN@2 -8.89,7.62; +VOUT 11.43,7.62; -VIN@1 -11.43,-7.62; -VIN@2 -8.89,-7.62; -VOUT 6.35,7.62; NO_CON 11.43,-7.62
SOIC127P1032X265-20N = smd 1.981 x 0.559: 1 -4.699,5.715; 2 -4.699,4.445; 3 -4.699,3.175; 4 -4.699,1.905; 5 -4.699,0.635; 6 -4.699,-0.635; 7 -4.699,-1.905; 8 -4.699,-3.175; 9 -4.699,-4.445; 10 -4.699,-5.715; 11 4.699,-5.715; 12 4.699,-4.445; 13 4.699,-3.175; 14 4.699,-1.905; 15 4.699,-0.635; 16 4.699,0.635; 17 4.699,1.905; 18 4.699,3.175; 19 4.699,4.445; 20 4.699,5.715
MKDSN1,5/2-5,08 = drill 1.3 pad 2: 1 -2.561,0.025; 2 2.519,0.025
22-23-2021 = drill 1 long: 1 -1.27,0; 2 1.27,0
MKDSN1,5/4-5,08 = drill 1.3 pad 2: 1 -7.641,0.025; 2 -2.561,0.025; 3 2.519,0.025; 4 7.599,0.025
22-23-2051 = drill 1 long: 1 -5.08,0; 2 -2.54,0; 3 0,0; 4 2.54,0; 5 5.08,0
22-23-2041 = drill 1 long: 1 -3.81,0; 2 -1.27,0; 3 1.27,0; 4 3.81,0
MKDSN1,5/3-5,08 = drill 1.3 pad 2: 1 -7.641,0.025; 2 -2.561,0.025; 3 2.519,0.025
TBU-CA = smd 1.85 x 3.4: 1 -2,0; 3 2,0 | smd 0.8 x 3.4: 2 0,0

### Placement (x,y rotation side)
C1  165.08,21.21 270 top
C2  88.19,18.73 270 top
C3  60.82,73.09 270 top
C4  38.4,18.54 270 top
C5  104.51,60.39 0 top
C6  11.29,43.37 180 top
C7  157.02,76.52 0 top
C8  159.24,53.28 90 top
C9  157.08,70.93 180 top
C10  12.18,36.58 0 top
C11  111.43,54.23 270 top
C12  117.33,54.23 90 top
C13  16.81,28.13 90 top
C14  8.81,73.15 90 top
C15  8.68,17.27 90 top
C16  45.83,58.29 270 top
C17  56.75,83.25 0 top
C18  49.26,83.38 0 top
C19  73.58,57.59 180 top
C20  73.58,54.42 180 top
C21  84.06,57.59 0 top
C22  84.06,54.42 0 top
C23  84.06,30.8 0 top
C24  84.06,34.35 0 top
C25  73.26,36.2 180 top
C26  73.26,29.4 180 top
D1  158.61,14.03 0 top
D2  149.65,14.03 0 top
D3  141.08,14.03 0 top
D4  131.81,13.97 0 top
D5  122.86,13.97 0 top
D6  113.65,13.91 0 top
D7  104.76,13.91 0 top
D8  95.3,13.97 0 top
D9  156.7,18.54 180 top
D10  147.75,18.54 180 top
D11  139.18,18.54 180 top
D12  129.91,18.54 180 top
D13  120.95,18.54 180 top
D14  111.74,18.54 180 top
D15  102.85,18.54 180 top
D16  93.39,18.54 180 top
D17  78.53,23.88 180 top
D18  43.35,18.48 180 top
D19  50.4,18.48 180 top
D20  57.83,18.48 180 top
D21  65.14,18.48 180 top
D22  41.45,13.97 0 top
D23  48.5,13.91 0 top
D24  55.93,13.91 0 top
D25  63.23,13.91 0 top
G1  86.28,75.63 180 bottom
GDT1  81.65,14.1 0 top
GDT2  75.36,14.1 0 top
IC1  10.97,28.45 180 top
IC2  48.31,49.21 270 top
IC3  127.11,40.2 270 top
IC4  48.56,69.28 225 top
IC5  74.91,67.18 180 top
IC6  95.87,50.86 270 top
IC7  126.79,57.53 90 top
IC8  101.08,67.75 90 top
J1  18.14,76.26 180 top
JP1  31.8,57.72 0 bottom
JP2  37.13,83.38 0 top
JP3  153.15,40.2 270 bottom
JP4  101.65,42.61 180 top
JP5  133.4,81.41 180 top
L1  74.22,32.51 270 top
L2  72.31,32.51 270 top
LCD1  143.49,51.88 0 bottom
MOD1  21.7,26.35 0 top
OC1  157.97,27.62 0 top
OC2  149.02,27.5 0 top
OC3  140.45,27.56 0 top
OC4  131.17,27.62 0 top
OC5  122.22,27.62 0 top
OC6  113.01,27.62 0 top
OC7  104.12,27.43 0 top
OC8  94.66,27.43 0 top
OC9  63.87,27.43 180 top
OC10  56.56,27.43 180 top
OC11  49.13,27.43 180 top
OC12  42.08,27.43 180 top
Q1  53.01,79.38 0 top
Q2  68.88,79.25 180 top
R1  65.07,37.59 90 top
R2  61.01,40.26 90 top
R3  21.51,58.04 270 top
R4  24.56,58.04 90 top
R5  18.4,58.1 270 top
R6  15.35,58.1 90 top
R7  8.75,58.1 270 top
R8  12.05,58.1 90 top
R9  57.51,43.18 90 top
R10  54.09,45.91 90 top
R11  147.3,40.45 0 top
R12  8.75,68.58 90 top
R13  147.3,43.69 0 top
R14  116.19,43.69 90 top
U1  157.21,61.98 270 bottom
U2  78.66,44.26 270 top
X1  156.89,82.99 180 bottom
X2  161.59,40.26 270 bottom
X3  109.2,7.68 0 bottom
X4  145.65,7.62 0 bottom
X5  44.05,40.58 0 top
X6  141.27,41.72 270 bottom
X7  52.31,7.24 180 bottom
X8  75.93,7.37 0 bottom
Z1  83.55,22.92 90 top
Z2  73.39,22.86 90 top

### Tracks (layer width: path | path; a pad name or v marks a point on that pad's centre or on a via)
485_R/W  (via drill 0.4)
  Top 0.406: IC4.2 54.18,72.07 | 54.18,72.07 54.28,72.07 | 54.18,72.07 v59.71,66.55 | v79.3,66.55 U2.5 U2.6
  Bottom 0.406: v59.71,66.55 v79.3,66.55
+3V3  (via drill 0.4)
  Top 0.406: C14.1 8.75,72.14 R12.2 5.57,69.53 v5.57,62.42 | C13.1 16.81,25.35 IC1.TAB
  Top 0.61: v5.57,62.42 5.57,25.35 IC1.TAB 10.97,19.97 C15.+ | J1.VDD 18.5,62.45 v18.46,62.42
  Top 0.813: IC1.2 IC1.TAB
  Bottom 0.61: v18.46,62.42 v5.57,62.42
+5V  (via drill 0.4, 0.6)
  Top 0.406: 75.55,48.96 U2.8 75.48,51.18 v74.53,52.13 v74.53,52.14 C20.1 C19.1 | U2.2 | 148.25,47.88 148.26,47.88 | 83.04,48.96 U2.2 | 122.19,53.02 IC7.16 | IC8.2 IC8.1 100.57,63.31 | 134.63,47.88 134.63,44.64 IC3.16 | R14.2 IC3.1 122.51,47.72 v122.67,47.88 | IC7.2 128.19,54.36 126.92,53.09 IC7.16 | 100.57,63.31 IC8.16 | 100.57,63.31 v100.57,60.64 103.3,60.64 C5.1 | IC7.16 119.43,53.09 v119.43,53.15 117.46,53.15 C12.1 | 8.43,43.37 C6.+ | IC4.6 49.53,71.95 49.51,71.95 | 49.51,71.95 50.66,70.8 IC4.4 | 76.88,64.52 IC5.8 76.82,62.93 75.61,61.72 75.61,59.37 69.33,59.37 | v36.24,50.48 36.24,58.99 JP1.2 34.4,59.05 34.4,63.5 33.32,64.58 JP2.1 | C8.1 159.31,52.26 159.31,47.24 | IC6.16 100.53,55.37 v109.01,55.37 111.23,55.37 C11.1 | C10.1 11.23,36.51 8.66,36.51 | U2.2 v83.11,52.13 v83.11,52.14 C22.1 C21.1 | IC4.18 48.4,71.95 49.51,71.95 | IC2.2 v45.33,48.26 v45.32,48.26 | C3.1 v57.01,74.04 | 161.59,41.47 X2.1 | JP3.1 153.15,47.88
  Top 0.61: 100.57,55.31 IC6.16 | IC1.3 8.66,36.51 8.66,43.37 C6.+ 8.59,47.31 MOD1.VCC | IC4.4 53.89,74.04 v57.01,74.04
  Top 0.813: 133.33,84.9 LCD1.16 133.4,84.9 JP5.2 v133.4,63.06 | X6.1 141.27,47.82 141.21,47.88 | 8.37,43.53 C6.+ | 159.31,47.24 159.31,47.88 | v69.33,50.48 69.33,59.37 v69.33,74.04
  Top 1.27: v122.67,47.88 v133.46,47.88 134.63,47.88 141.21,47.88 148.26,47.88 149.59,47.88 | 149.59,47.88 153.15,47.88 159.31,47.88 | X2.1 159.31,41.53 159.31,47.24 | U1.+VOUT 149.59,47.88
  Bottom 0.406: v100.57,60.64 109.01,60.64 v109.01,55.37 108.95,50.67 | v119.43,53.15 119.43,48.07 119.62,47.88 | v74.53,52.13 74.53,50.57 74.6,50.51 | v83.11,52.13 83.11,50.61 83.17,50.55 | v45.32,48.26 45.32,50.42 45.39,50.48
  Bottom 0.813: v133.4,63.06 133.46,63.06 133.46,59.18 | 133.46,59.18 v133.46,47.88 | LCD1.2 141.27,59.18 133.46,59.18 | MOD1.VCC 19.86,50.42 v36.24,50.48 45.39,50.48 v69.33,50.48 | v69.33,74.04 v57.01,74.04
  Bottom 1.27: v122.67,47.88 119.62,47.88 114.73,47.88 112.31,50.67 108.95,50.67 83.17,50.55 75.49,50.51 74.6,50.51 v69.33,50.48
+24V  (via drill 0.6)  (1 unrouted)
  Top 0.406: D9.2 153.46,19.64 153.46,25.4 | D10.2 144.89,19.64 144.89,25.4 | D11.2 136,19.64 136,25.4 | 90.41,19.68 v90.41,25.46 | 90.41,19.68 92.44,19.68 D16.2 | D15.2 99.87,19.64 99.87,25.4 | D14.2 108.76,19.64 108.76,25.4 | D13.2 118.09,19.64 118.09,25.4 | D12.2 126.73,19.64 126.73,25.4 | OC9.3 62.59,19.58 D21.2 | OC10.3 55.29,19.58 D20.2 | OC11.3 47.86,19.58 D19.2 | OC12.3 40.81,19.58 D18.2 | C4.1 38.4,25.46 40.81,25.46 | C2.1 90.41,19.68 | C1.1 165.08,25.4 | C7.1 154.38,76.52 C9.+
  Top 0.61: OC12.3 40.81,25.46 47.86,25.46 | 47.86,25.46 OC11.3 | 55.29,25.46 OC10.3 | 55.29,25.46 47.86,25.46 | OC9.3 62.59,25.46 | 62.59,25.46 55.29,25.46 | 62.59,25.46 68.82,25.46 v68.88,25.53
  Top 1.27: 90.41,25.4 99.87,25.4 108.76,25.4 118.09,25.4 126.73,25.4 136,25.4 144.89,25.4 153.46,25.4 165.08,25.4 169.66,25.4 169.66,65.98 149.59,65.98 U1.+VIN@2 | X1.1 149.59,82.97 U1.+VIN@1 U1.+VIN@2 | C9.+ 149.59,70.93 U1.+VIN@2
  Bottom 0.61: v68.88,25.53 90.34,25.53 v90.41,25.46
A-
  Top 0.406: U2.18 81.84,37.02 81.01,36.19 81.01,24.88 80.95,24.88 D17.1
  Top 1.016: 80.95,24.88 83.55,24.88 Z1.3
B+
  Top 0.406: U2.17 80.56,37.4 79.74,36.58 79.74,27.03 D17.2 73.41,24.88 Z2.3
E_RESET  (via drill 0.4)
  Top 0.406: v37.64,46.61 37.58,46.61 37.64,46.67 37.64,49.53 38.21,50.1 38.21,51.24 37.32,52.13 37.32,68.96 41.7,73.34 43.93,73.34 IC4.13
  Bottom 0.406: v37.64,46.61 36.31,45.28 36.31,38.93 22.34,38.93 MOD1.RESET
E_SELECT  (via drill 0.4)
  Top 0.406: v39.42,48.39 39.42,52.13 38.4,53.15 38.46,53.21 38.46,68.71 42.27,72.52 43.63,72.52 IC4.14
  Bottom 0.406: v39.42,48.39 32.56,48.39 31.92,49.02 24.05,49.02 MOD1.SS
GND
  Top 0.406: 123.87,35.75 IC3.8 126.67,35.75 126.67,30.29 | 123.87,35.75 124.57,35.75 124.57,42.1 | 124.57,42.1 IC3.3 | IC3.2 124.57,43.37 124.57,42.1 | 123.75,35.62 123.87,35.75 | OC1.4 156.7,30.29 147.62,30.29 | 139.24,30.29 147.62,30.29 | 129.84,30.29 139.24,30.29 | 126.67,30.29 120.89,30.29 | 126.67,30.29 129.84,30.29 | 111.74,30.29 120.89,30.29 | 102.73,30.29 111.74,30.29 | OC2.4 147.62,32.27 147.62,30.29 | OC3.4 139.24,32.33 139.24,30.29 | OC4.4 129.84,32.39 129.84,30.29 | OC5.4 120.89,32.39 120.89,30.29 | OC6.4 111.74,30.29 | OC7.4 102.73,32.2 102.73,30.29 | OC8.4 93.39,30.29 102.73,30.29 | OC9.2 62.59,30.54 55.29,30.54 | 55.29,30.54 OC10.2 | 47.86,30.54 OC11.2 | 47.86,30.54 55.29,30.54 | OC12.2 40.81,30.54 47.86,30.54 | IC7.8 135.94,61.98 135.94,62.17 | IC7.1 135.94,53.09 135.94,55.63 | 135.94,55.63 135.94,61.53 | IC7.3 135.94,55.63 | IC8.8 103.3,72.2 103.3,65.91 105.68,65.91 IC8.3 | JP5.1 135.94,81.34
  Top 0.813: 135.94,62.17 135.94,81.34 LCD1.15 | 135.94,61.53 135.94,62.17 | LCD1.1 138.73,62.17 135.94,62.17
  pour Top: 1.13,87.57 144.64,87.63 144.64,58.36 163.56,58.36 163.56,29.78 89.58,29.84 89.58,41.78 85.07,45.78 71.87,45.78 67.67,42.35 67.67,29.91 33.83,29.91 33.83,21.08 15.67,21.08 15.67,1.21 1.13,1.14
  pour Bottom: 1.06,87.63 144.57,87.69 144.57,58.36 163.56,58.36 163.56,29.84 89.52,29.91 89.52,41.85 85.01,45.85 71.8,45.85 67.61,42.42 67.61,29.97 33.77,29.97 33.77,21.15 15.67,21.08 15.67,1.21 1.06,1.21
GND1
  Top 0.406: 150.16,22.73 OC2.2 | 132.57,22.85 OC4.2 | 78.49,14.1 GDT1.1 | 78.49,14.1 GDT2.2 | 78.49,14.1 X8.2 | U2.20 84.38,37.91 84.95,37.34 84.95,34.41 C24.2 C23.2 | D18.1 45.01,19.58 45.01,10.54 47.23,8.32 | C7.2 159.78,76.52 C9.-
  pour Top: 36.75,1.4 36.75,27.62 69.83,27.81 69.83,40.77 72.12,42.74 85.14,42.67 87.11,40.7 87.11,27.69 167.37,27.56 167.37,60.9 148,60.9 148,87.57 173.97,87.57 174.04,25.46 174.04,0.95
  pour Bottom: 36.75,1.4 36.75,27.62 69.83,27.81 69.83,40.77 72.12,42.74 85.14,42.67 87.11,40.7 87.11,27.69 167.37,27.56 167.37,60.9 148,60.9 148,87.57 173.97,87.57 174.04,25.46 174.04,0.95
I_CONTRAST  (via drill 0.6)
  Top 0.406: 130.86,81.34 LCD1.17 | 130.86,81.34 v130.86,64.52 | JP5.3 130.86,81.34
  Bottom 0.305: v130.86,64.52 138.67,64.52
  Bottom 0.406: 138.67,64.52 LCD1.3
I_D0  (via drill 0.6)
  Top 0.406: LCD1.21 v120.7,69.85 120.7,67.12 IC8.4
  Bottom 0.305: LCD1.7 120.7,69.66
  Bottom 0.406: 120.7,69.66 v120.7,69.85
I_D1  (via drill 0.6)
  Top 0.406: LCD1.22 v118.16,70.93 118.16,68.39 IC8.5
  Bottom 0.305: LCD1.8 140,70.93 v118.16,70.93
I_D2  (via drill 0.6)
  Top 0.406: LCD1.23 v115.62,72.14 115.62,69.66 IC8.6
  Bottom 0.305: LCD1.9 115.62,72.2
  Bottom 0.406: 115.62,72.2 v115.62,72.14
I_D3  (via drill 0.6)
  Top 0.406: LCD1.24 v113.08,73.47 113.08,70.93 IC8.7
  Bottom 0.305: LCD1.10 140,73.47 v113.08,73.47
I_D4  (via drill 0.6)
  Top 0.406: LCD1.25 v110.54,74.55 96.48,74.55 IC8.9
  Bottom 0.305: LCD1.11 110.54,74.74
  Bottom 0.406: 110.54,74.74 v110.54,74.55
I_D5  (via drill 0.6)
  Top 0.406: LCD1.26 v108,76.01 94.09,76.01 94.09,70.99 96.48,70.99 IC8.10
  Bottom 0.305: LCD1.12 140,76.01 v108,76.01
I_D6  (via drill 0.6)
  Top 0.406: LCD1.27 v105.46,77.34 93.27,77.34 93.27,69.6 96.48,69.6 IC8.11
  Bottom 0.305: LCD1.13 105.46,77.28
  Bottom 0.406: 105.46,77.28 v105.46,77.34
I_D7  (via drill 0.6)
  Top 0.406: LCD1.28 v102.92,78.93 92.38,78.93 92.38,68.39 IC8.12
  Bottom 0.305: LCD1.14 139.62,78.93 v102.92,78.93
I_E  (via drill 0.6)
  Top 0.406: LCD1.20 v123.24,68.39 123.24,61.98 IC7.9 122.16,61.98
  Bottom 0.305: LCD1.6 140,68.39 v123.24,68.39
I_RS  (via drill 0.6)
  Top 0.406: LCD1.18 v128.32,65.85 128.32,59.44 IC7.11
  Bottom 0.305: LCD1.4 140,65.85 v128.32,65.85
I_RW  (via drill 0.6)
  Top 0.406: LCD1.19 v125.78,67.25 125.78,60.71 IC7.10
  Bottom 0.305: LCD1.5 125.78,67.12
  Bottom 0.406: 125.78,67.12 v125.78,67.25
INT0  (via drill 0.4)
  Top 0.406: v106.98,52.83 105.65,51.5 IC6.13 | IC4.32 61.26,60.54 v61.26,57.09
  Bottom 0.406: v106.98,52.83 105.9,53.91 74.09,53.91 70.91,57.09 v61.26,57.09
INT1  (via drill 0.4)
  Top 0.406: IC3.13 129.97,40.83 129.21,40.07 125.59,40.07 v125.59,45.66 | IC4.1 62.79,61.13 62.79,50.67 v64.95,48.51
  Bottom 0.406: v125.59,45.66 113.46,45.66 110.6,48.51 v64.95,48.51
MISO  (via drill 0.4)
  Top 0.406: MOD1.MISO 27.42,42.93 34.34,42.93 | JP1.1 34.34,42.93 | 21.83,67.64 J1.DAT0 21.8,64.61 v22.91,63.5 | X5.2 41.51,42.93 | 34.34,42.93 41.51,42.93 | 41.51,42.93 41.58,42.93 42.21,43.56 42.21,51.12 41.64,51.69 41.64,54.29 41.13,54.8 v41.13,63.5 41.13,67.92 IC4.16
  Bottom 0.406: v22.91,63.5 v41.13,63.5
MOSI  (via drill 0.4)
  Top 0.406: v44.12,44.83 44.12,40.64 X5.3 | R5.2 18.4,53.47 v18.46,53.47 18.46,50.48 24.88,50.48 MOD1.MOSI | v40.5,44.89 40.5,53.66 39.73,54.42 39.73,60.52 v39.67,60.58 39.67,68.77 42.53,71.63 43.38,71.63 IC4.15
  Bottom 0.406: v40.5,44.89 44.05,44.89 v44.12,44.83 | JP1.4 31.8,60.58 | 31.8,60.58 v39.67,60.58 | 18.46,53.4 v18.46,53.47 21.32,53.47 28.43,60.58 31.8,60.58
N$1
  Top 0.406: GDT1.2 83.59,7.39 X8.1
  Top 1.27: GDT1.2 83.55,14.1 Z1.1
N$2
  Top 0.406: GDT2.1 X8.3
  Top 1.27: GDT2.1 73.39,14.1 Z2.1
N$3  (via drill 0.6)
  Top 0.406: U2.19 C24.1 C23.1 v83.11,28.13 | v76.88,28.07 76.95,28.07 76.95,29.4 C26.1 L1.2
  Bottom 0.406: v76.88,28.07 83.11,28.07 v83.11,28.13
N$4
  Top 0.406: U2.14 76.76,41.47 72.95,41.47 U2.11 72.95,38.04 72.37,37.47 72.37,36.26 C25.2 L2.1
N$5
  Top 0.406: U2.12 C25.1 | L1.1 C25.1 | C25.1
N$6
  Top 0.406: R10.2 54.09,49.91 47.93,56.07 47.93,60.96 47.86,60.96 46.15,62.67 46.15,64.04 IC4.23
N$7
  Top 0.406: IC4.24 49.07,62.7 49.07,56.58 57.51,48.13 R9.2
N$8
  Top 0.406: IC4.25 50.08,63.79 50.08,57.59 61.07,46.61 61.07,41.27 R2.2
N$9
  Top 0.406: IC4.26 51.04,63.97 51.04,58.42 65.07,44.39 R1.2
N$10
  Top 0.305: OC12.4 D18.3
  Top 0.406: D22.A D18.3
N$11
  Top 0.305: OC11.4 D19.3
  Top 0.406: D23.A D19.3
N$12
  Top 0.305: D20.3 OC10.4
  Top 0.406: D24.A D20.3
N$13
  Top 0.305: OC9.4 D21.3
  Top 0.406: D25.A D21.3
N$14
  Top 0.406: Q1.1 48.47,79.31 | IC4.8 48.12,75.79 Q1.1 | 48.31,79.5 Q1.1 | C18.1 48.31,79.5 Q1.1
N$15
  Top 0.406: OC9.1 65.14,36.58 R1.1
N$16
  Top 0.305: OC1.1 D9.3
  Top 0.406: D9.3 D1.C
N$17
  Top 0.305: OC2.1 D10.3
  Top 0.406: D10.3 D2.C
N$18
  Top 0.406: OC10.1 57.83,34.1 61.01,37.27 R2.1
N$19
  Top 0.406: R9.1 57.51,40.83 50.4,33.72 OC11.1
N$20
  Top 0.406: IC5.3 74.28,67.75 86.28,67.75 G1.+
N$21
  Top 0.406: X4.1 157.59,11.94 160.51,11.94 D1.A
N$22
  Top 0.406: X4.2 151.55,10.98 D2.A
N$23
  Top 0.406: Q2.1 76.82,80.52 IC5.1
N$24
  Top 0.305: OC3.1 D11.3
  Top 0.406: D11.3 D3.C
N$25
  Top 0.406: Q2.4 75.55,77.34 IC5.2
N$26
  Top 0.406: Q1.2 57.77,79.31 | Q1.2 57.61,79.31 | 57.26,79.31 55.77,79.31 | 57.26,79.31 Q1.2 | C17.2 57.7,79.75 57.26,79.31 | IC4.7 53.29,76.83 57.51,76.83 57.77,77.09 Q1.2
N$27
  Top 0.305: OC4.1 D12.3
  Top 0.406: D12.3 D4.C
N$28
  Top 0.406: D7.A 106.66,7.71 X3.3
N$29
  Top 0.406: OC12.1 43.35,35.31 48.75,35.31 54.09,40.64 R10.1
N$30
  Top 0.305: OC5.1 D13.3
  Top 0.406: D13.3 D5.C
N$32
  Top 0.305: OC6.1 D14.3
  Top 0.406: D14.3 D6.C
N$33
  Top 0.406: X4.4 133.71,11.99 D4.A
N$34
  Top 0.305: OC7.1 D15.3
  Top 0.406: D15.3 D7.C
N$35
  Top 0.406: X4.3 142.98,7.8 D3.A
N$36
  Top 0.254: OC8.1 D16.3
  Top 0.406: OC8.1 | D16.3 D8.C
N$37
  Top 0.406: X3.1 120.5,11.37 124.76,11.37 D5.A
N$38
  Top 0.406: D6.A 115.55,10.79 111.87,10.79 111.87,7.71 X3.2
N$39
  Top 0.406: X3.4 97.2,12.12 D8.A
N$40
  Top 0.406: IC3.6 119.11,38.29 116.57,35.75 114.28,35.75 OC6.3
N$41
  Top 0.406: OC7.3 105.39,37.27 116.38,37.27 118.67,39.56 IC3.5
N$42
  Top 0.406: OC8.3 95.93,38.35 115.87,38.35 118.29,40.77 122.45,40.77 IC3.4
N$43
  Top 0.406: J1.DAT3 16.3,64.63 12.05,60.39 R8.2 | 12.3,59.12 R8.2 | R8.2 R7.1
N$45
  Top 0.406: JP4.2 109.27,50.23 IC6.12
N$46
  Top 0.406: JP4.3 106.73,48.96 IC6.11
N$47
  Top 0.406: JP4.4 104.19,47.69 IC6.10
N$48
  Top 0.406: IC6.5 98.03,50.23 98.03,44.51 99.11,43.43 JP4.6
N$49
  Top 0.406: JP4.5 101.65,46.42 IC6.9
N$50
  Top 0.406: 91.49,47.69 IC6.7 93.27,47.69 93.27,45.4 91.49,43.62 JP4.9
N$51
  Top 0.406: IC6.6 96.57,48.96 JP4.7
N$53
  Top 0.406: JP4.8 94.03,39.37 115.17,39.37 116.19,40.39 R14.1
N$54
  Top 0.406: OC1.3 159.24,35.56 137.52,35.56 137.52,39.56 IC3.12
N$55
  Top 0.406: OC2.3 150.29,34.61 136.44,34.61 136.44,38.29 IC3.11
N$56
  Top 0.406: OC3.3 141.72,33.72 135.11,33.72 135.11,37.02 IC3.10
N$57
  Top 0.406: IC3.9 131.71,34.48 132.38,34.48 132.38,32.39 OC4.3
N$58
  Top 0.406: IC3.7 119.62,37.02 119.62,34.29 123.49,34.29 OC5.3
N$59
  Top 0.406: 19.16,59.18 R5.1 R6.2 | R6.2 15.92,59.12 | J1.CMD 17.39,64.21 15.41,62.23 15.41,59.12 R6.2
N$60
  Top 0.406: R4.2 R3.1 21.51,62.42 19.59,64.34 J1.CLK
N$61
  Top 0.406: C16.1 44.43,59.24 44.43,65.79 44.5,65.79 IC4.20
N$62
  Top 0.406: D22.C 39.55,10.79 43.1,7.24 44.64,7.24 X7.1
N$63
  Top 0.406: D23.C 46.6,11.93 49.7,8.83 49.7,7.26 X7.2
N$64
  Top 0.406: IC4.10 38.4,82.27 JP2.3
N$65
  Top 0.406: D24.C 54.03,7.21 X7.3
N$66
  Top 0.406: IC4.9 40.94,80.86 JP2.4
N$67
  Top 0.406: D25.C 61.33,7.21 X7.4
N$68
  Top 0.406: R13.2 R11.2 148.25,38.93 JP3.2
RESET  (via drill 0.4)
  Top 0.406: IC4.29 57.26,61.14 v57.26,57.21 | IC2.1 47.21,53.04 v45.39,54.86
  Bottom 0.406: v57.26,57.21 47.74,57.21 v45.39,54.86 44.37,53.85 29.26,53.85 JP1.5
RXD  (via drill 0.4)
  Top 0.406: IC4.30 58.34,61.2 v58.34,58.42 | v80.56,57.15 U2.4
  Bottom 0.406: 80.56,57.21 v80.56,57.15 73.33,57.15 72.06,58.42 v58.34,58.42
SCK  (via drill 0.4)
  Top 0.406: IC4.17 42.72,67.27 42.72,52.77 v43.42,52.07 | X5.1 v32.5,40.58 24.88,40.58 MOD1.SCK | v32.43,45.08 v32.43,52.07 31.8,52.71 JP1.3 | v22.21,52.07 21.51,52.77 R3.2
  Bottom 0.406: v22.21,52.07 v32.43,52.07 v43.42,52.07 | v32.43,45.08 32.5,45.08 v32.5,40.58
SCL  (via drill 0.4)
  Top 0.406: R11.1 X6.3 141.21,40.39 139.05,40.39 137.33,42.1 IC3.14 v129.33,42.1 | v100.63,65.85 IC8.14 92.57,65.85 v92.57,59.75 | IC7.14 124.38,55.63 125.52,56.77 129.27,56.77 v129.33,56.71 | IC6.14 96.44,52.77 94.03,55.18 v94.03,56.58 | v74.22,60.9 74.22,64.52 IC5.6 | IC4.28 55.29,61.98 v55.29,60.83
  Bottom 0.406: 92.57,59.82 v92.57,59.75 | v129.33,42.1 v129.33,56.71 129.33,59.94 123.43,65.85 v100.63,65.85 | v92.57,59.75 75.36,59.75 v74.22,60.9 55.36,60.9 v55.29,60.83 | v92.57,59.75 94.03,59.75 v94.03,56.58
SD_DETECT  (via drill 0.4)
  Top 0.406: R12.1 12.78,67.63 J1.CD 12.79,64.45 v12.81,64.45 | v34.59,65.47 34.53,65.47 34.53,68.77 40.81,75.06 44.48,75.06 IC4.11
  Bottom 0.406: v34.59,65.47 12.81,65.47 v12.81,64.45
SD_SELECT  (via drill 0.4)
  Top 0.406: v8.75,54.67 R7.2 | IC4.12 44.24,74.17 41.26,74.17 36.05,68.96 v36.05,62.1
  Bottom 0.406: v8.75,54.67 8.75,54.74 17,54.74 24.37,62.1 v36.05,62.1
SDA  (via drill 0.4)
  Top 0.406: R13.1 144.32,43.69 143.68,43.05 141.33,43.05 X6.2 138.92,42.99 138.54,43.37 IC3.15 v127.05,43.37 | IC8.15 94.28,64.58 v94.28,62.17 | 100.47,54.1 IC6.15 97.71,54.04 96.19,55.56 v96.19,56.58 | IC5.5 73.01,62.1 v71.87,62.1 | IC4.27 52.05,64.09 v52.05,62.1 | IC7.15 124.89,54.36 126.09,55.56 v126.98,55.56
  Bottom 0.406: v71.87,62.1 71.87,62.17 | 96.12,62.1 94.28,62.1 v94.28,62.17 90.73,62.17 89.65,61.09 82.34,61.09 81.33,62.1 v71.87,62.1 | 96.12,62.1 123.24,62.1 126.98,58.36 v126.98,55.56 126.98,43.43 v127.05,43.37 | v71.87,62.1 v52.05,62.1 | 96.25,56.64 v96.19,56.58 96.19,62.04 96.12,62.1
SPI0
  Top 0.406: IC4.19 43.61,66.02 43.61,54.42 44.94,53.09 44.94,50.29 43.99,49.34 43.99,46.48 44.05,46.42 46.59,46.42 X5.4
TXD  (via drill 0.4)
  Top 0.406: v77.71,58.67 77.71,53.91 76.76,52.96 U2.7 | v59.99,59.75 59.99,60.68 IC4.31
  Bottom 0.406: v77.71,58.67 74.28,58.67 73.2,59.75 v59.99,59.75